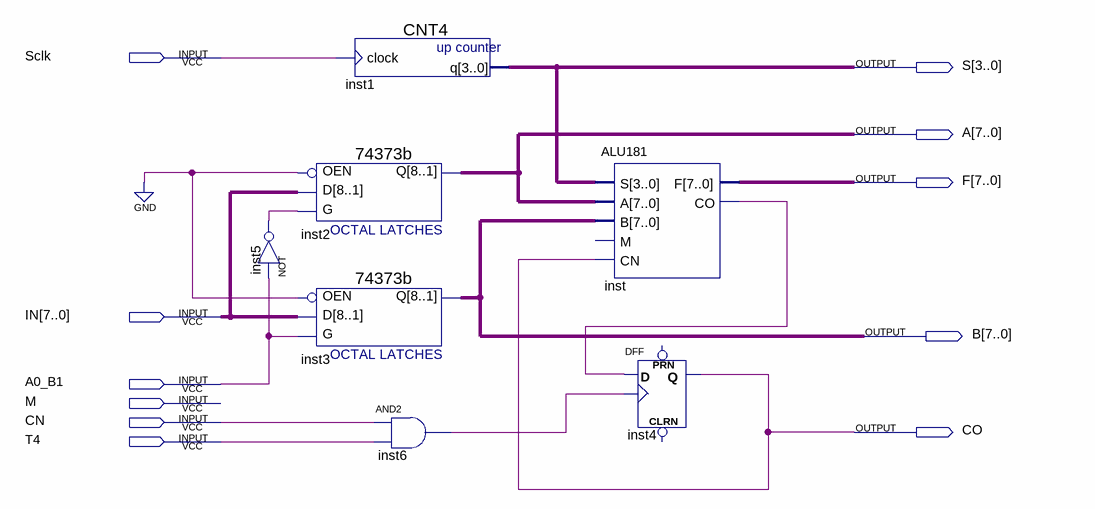
[diagram p0: schematic sheet]
// Quartus schematic ALU.bdf as structural Verilog: 7 symbols, 11 pins
module ALU (
  input  Sclk,
  input  [7:0] IN,
  input  A0_B1,
  input  M,
  input  CN,
  input  T4,
  output [3:0] S,
  output [7:0] A,
  output [7:0] F,
  output [7:0] B,
  output CO
);

  wire inst5_out, inst6_out, inst_co;

  \74373b  inst2 (.D(IN), .G(inst5_out), .OEN(1'b0), .Q(A));
  not inst5 (inst5_out, A0_B1);
  \74373b  inst3 (.D(IN), .G(A0_B1), .OEN(1'b0), .Q(B));
  CNT4 inst1 (.clock(Sclk), .q(S));
  and inst6 (inst6_out, CN, T4);
  ALU181 inst (.S(S), .A(A), .B(B), .CN(CO), .F(F), .CO(inst_co));  // open: M
  DFF inst4 (.CLK(inst6_out), .D(inst_co), .Q(CO));  // open: CLRN, PRN
endmodule
